# EAGLE design vt100-addon (EAGLE 6.4)
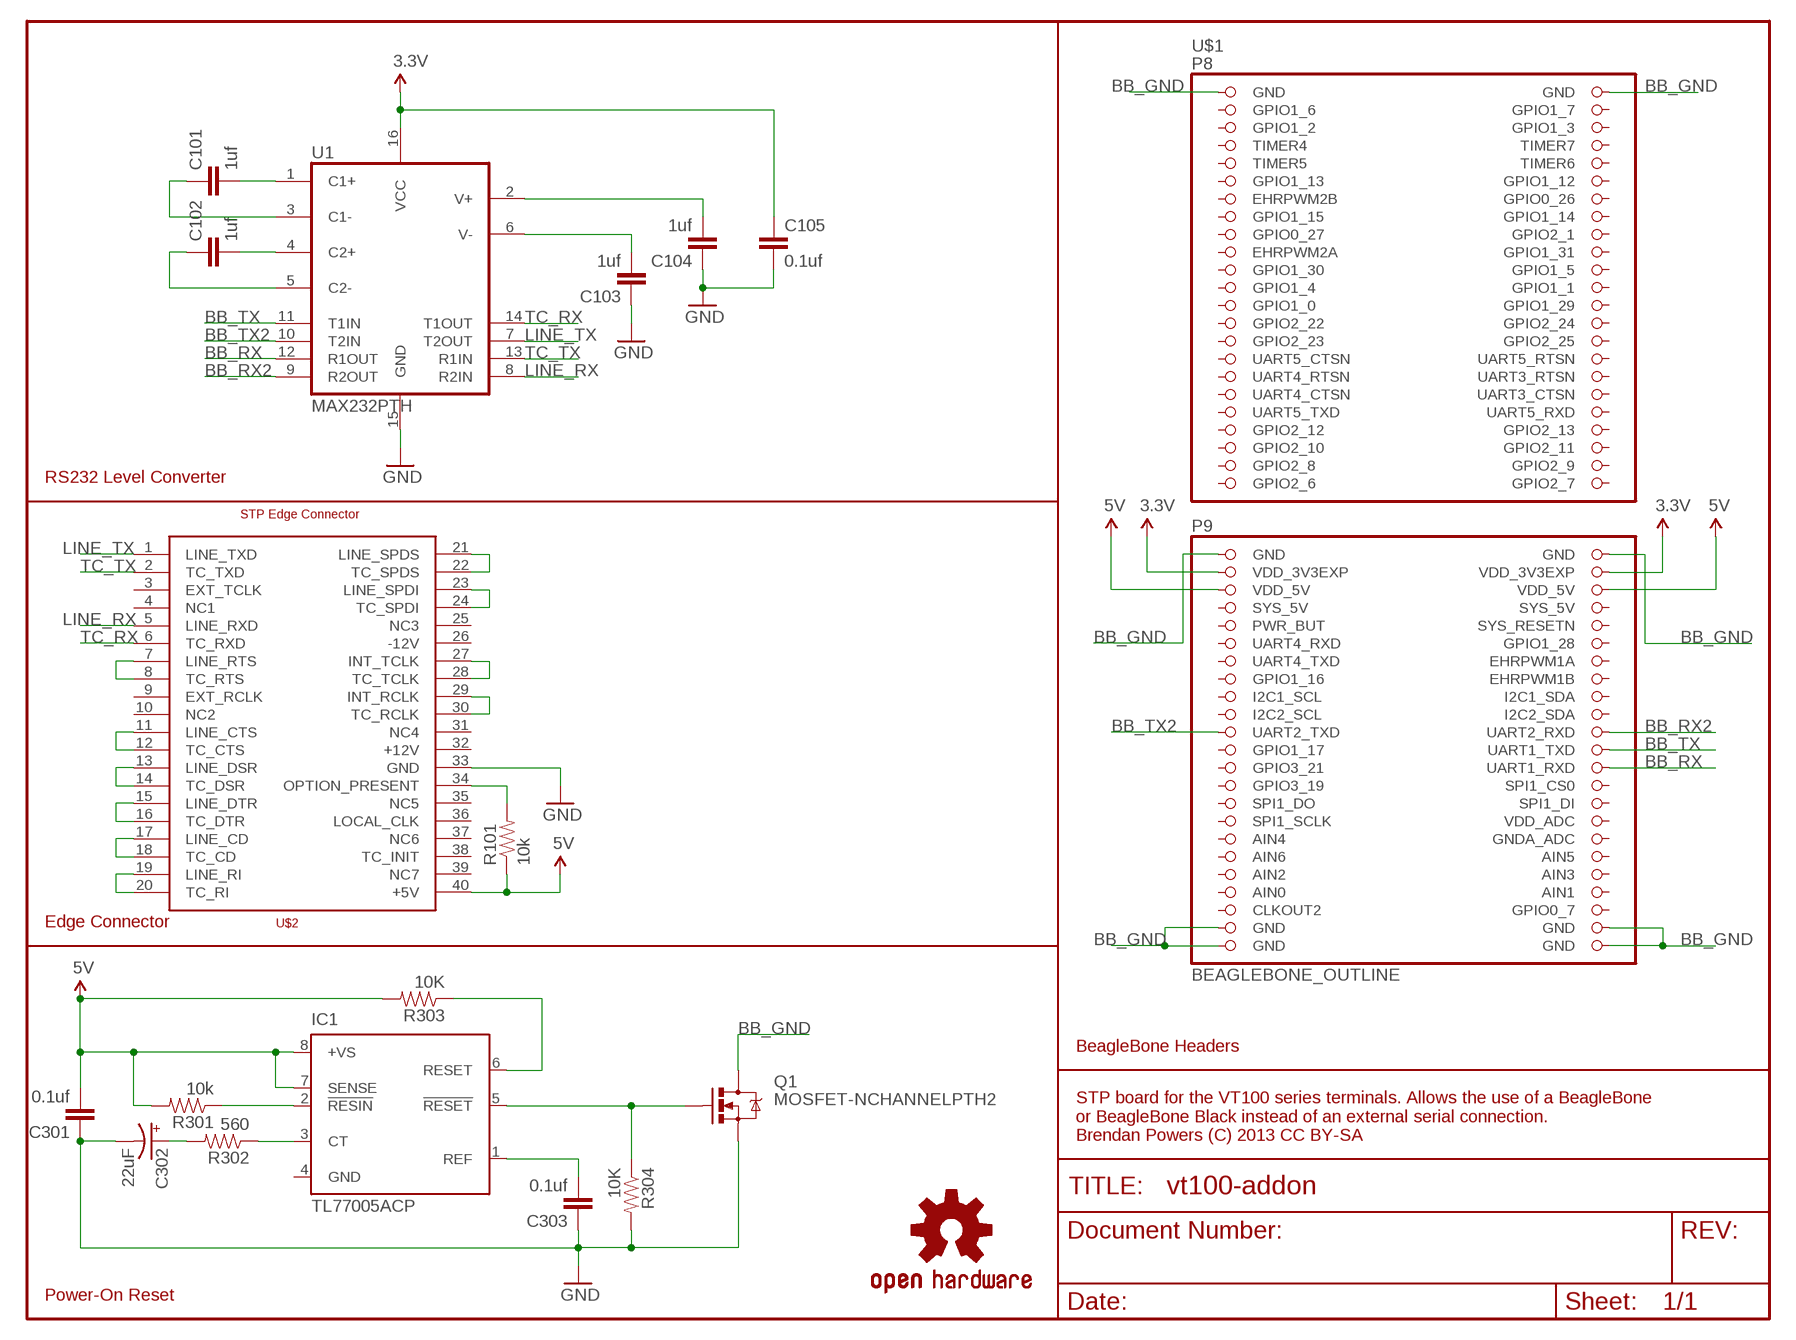
[diagram p0: schematic, sheet 1]

## Parts
C101  1uf  CAPPTH  [CAP-PTH-SMALL]
C102  1uf  CAPPTH  [CAP-PTH-SMALL]
C103  1uf  CAPPTH  [CAP-PTH-SMALL]
C104  1uf  CAPPTH  [CAP-PTH-SMALL]
C105  0.1uf  CAPPTH  [CAP-PTH-SMALL]
C301  0.1uf  CAPPTH  [CAP-PTH-SMALL]
C302  22uF  CAP_POLPTH1  [CPOL-RADIAL-100UF-25V]
C303  0.1uf  CAPPTH  [CAP-PTH-SMALL]
IC1  TL77005ACP  [DIL08]
Q1  MOSFET-NCHANNELPTH2  [TO220V]
R101  10k  RESISTORPTH-1/4W  [AXIAL-0.4]
R301  10k  RESISTORPTH-1/4W  [AXIAL-0.4]
R302  560  RESISTORPTH-1/4W  [AXIAL-0.4]
R303  10K  RESISTORPTH-1/4W  [AXIAL-0.4]
R304  10K  RESISTORPTH-1/4W  [AXIAL-0.4]
U1  MAX232PTH  [DIL16]
U$1  BEAGLEBONE_OUTLINE  [BEAGLEBONE_SHIELD]
U$2  STP_EDGE  [STP_EDGE]
U$7  OSHW-LOGOL  [OSHW-LOGO-L]

## Nets
3.3V: C105.1 U1.16(VCC) U$1.49(VDD_3V3EXP) U$1.50(VDD_3V3EXP)
5V: C301.2 IC1.7(SENSE) IC1.8(+VS) R101.P$1 R301.P$2 R303.P$2 U$1.51(VDD_5V) U$1.52(VDD_5V) U$2.40(+5V)
BB_GND: Q1.2(D) U$1.1(GND) U$1.2(GND) U$1.47(GND) U$1.48(GND) U$1.89(GND) U$1.90(GND) U$1.91(GND) U$1.92(GND)
BB_RX: U1.12(R1OUT) U$1.72(UART1_RXD)
BB_RX2: U1.9(R2OUT) U$1.68(UART2_RXD)
BB_TX: U1.11(T1IN) U$1.70(UART1_TXD)
BB_TX2: U1.10(T2IN) U$1.67(UART2_TXD)
GND: C103.1 C104.1 C105.2 C301.1 C302.2(-) C303.1 Q1.3(S) R304.P$2 U1.15(GND) U$2.33(GND)
LINE_RX: U1.8(R2IN) U$2.5(LINE_RXD)
LINE_TX: U1.7(T2OUT) U$2.1(LINE_TXD)
N$1: C101.2 U1.1(C1+)
N$2: C101.1 U1.3(C1-)
N$3: C102.2 U1.4(C2+)
N$4: C102.1 U1.5(C2-)
N$5: R101.P$2 U$2.34(OPTION_PRESENT)
N$6: C104.2 U1.2(V+)
N$7: C103.2 U1.6(V-)
N$8: U$2.7(LINE_RTS) U$2.8(TC_RTS)
N$9: U$2.11(LINE_CTS) U$2.12(TC_CTS)
N$10: U$2.13(LINE_DSR) U$2.14(TC_DSR)
N$11: U$2.15(LINE_DTR) U$2.16(TC_DTR)
N$12: U$2.17(LINE_CD) U$2.18(TC_CD)
N$13: U$2.19(LINE_RI) U$2.20(TC_RI)
N$14: U$2.21(LINE_SPDS) U$2.22(TC_SPDS)
N$15: U$2.23(LINE_SPDI) U$2.24(TC_SPDI)
N$16: U$2.27(INT_TCLK) U$2.28(TC_TCLK)
N$17: U$2.29(INT_RCLK) U$2.30(TC_RCLK)
N$18: IC1.3(CT) R302.P$1
N$19: C303.2 IC1.1(REF)
N$20: C302.1(+) R302.P$2
N$21: IC1.6(RESET) R303.P$1
N$22: IC1.5(!RESET) Q1.1(G) R304.P$1
N$24: IC1.2(!RESIN) R301.P$1
TC_RX: U1.14(T1OUT) U$2.6(TC_RXD)
TC_TX: U1.13(R1IN) U$2.2(TC_TXD)
Unconnected: U$1.3(GPIO1_6) U$1.4(GPIO1_7) U$1.5(GPIO1_2) U$1.6(GPIO1_3) U$1.7(TIMER4) U$1.8(TIMER7) U$1.9(TIMER5) U$1.10(TIMER6) U$1.11(GPIO1_13) U$1.12(GPIO1_12) U$1.13(EHRPWM2B) U$1.14(GPIO0_26) U$1.15(GPIO1_15) U$1.16(GPIO1_14) U$1.17(GPIO0_27) U$1.18(GPIO2_1) U$1.19(EHRPWM2A) U$1.20(GPIO1_31) U$1.21(GPIO1_30) U$1.22(GPIO1_5) U$1.23(GPIO1_4) U$1.24(GPIO1_1) U$1.25(GPIO1_0) U$1.26(GPIO1_29) U$1.27(GPIO2_22) U$1.28(GPIO2_24) U$1.29(GPIO2_23) U$1.30(GPIO2_25) U$1.31(UART5_CTSN) U$1.32(UART5_RTSN) U$1.33(UART4_RTSN) U$1.34(UART3_RTSN) U$1.35(UART4_CTSN) U$1.36(UART3_CTSN) U$1.37(UART5_TXD) U$1.38(UART5_RXD) U$1.39(GPIO2_12) U$1.40(GPIO2_13) U$1.41(GPIO2_10) U$1.42(GPIO2_11) U$1.43(GPIO2_8) U$1.44(GPIO2_9) U$1.45(GPIO2_6) U$1.46(GPIO2_7) U$1.54(SYS_5V) U$1.55(PWR_BUT) U$1.56(SYS_RESETN) U$1.57(UART4_RXD) U$1.58(GPIO1_28) U$1.59(UART4_TXD) U$1.60(EHRPWM1A) U$1.61(GPIO1_16) U$1.62(EHRPWM1B) U$1.63(I2C1_SCL) U$1.64(I2C1_SDA) U$1.65(I2C2_SCL) U$1.66(I2C2_SDA) U$1.69(GPIO1_17) U$1.71(GPIO3_21) U$1.73(GPIO3_19) U$1.74(SPI1_CS0) U$1.75(SPI1_DO) U$1.76(SPI1_DI) U$1.77(SPI1_SCLK) U$1.78(VDD_ADC) U$1.79(AIN4) U$1.80(GNDA_ADC) U$1.81(AIN6) U$1.82(AIN5) U$1.83(AIN2) U$1.84(AIN3) U$1.86(AIN1) U$1.87(CLKOUT2) U$1.88(GPIO0_7) U$2.3(EXT_TCLK) U$2.4(NC1) U$2.9(EXT_RCLK) U$2.10(NC2) U$2.25(NC3) U$2.26(-12V) U$2.31(NC4) U$2.32(+12V) U$2.35(NC5) U$2.36(LOCAL_CLK) U$2.37(NC6) U$2.38(TC_INIT) U$2.39(NC7)

## Notes on the sheet
- RS232 Level Converter
- Edge Connector
- BeagleBone Headers
- STP board for the VT100 series terminals. Allows the use of a BeagleBone
  or BeagleBone Black instead of an external serial connection.
  Brendan Powers (C) 2013 CC BY-SA
- Power-On Reset

## Power pins joined to a net without a drawn wire
AIN0: U$1.85(AIN0)
GND: IC1.4(GND)
SYS_5V: U$1.53(SYS_5V)

## Library data of the parts
C101-C105 C301 C303 = sparkfun:CAP: Capacitor Standard 0603 ceramic capacitor, and 0.1" leaded capacitor.
C302 = sparkfun:CAP_POL: Capacitor Polarized These are standard SMD and PTH capacitors. Normally 10uF, 47uF, and 100uF in electrolytic and tantalum varieties. Always verify the external diameter of the through hole cap, it varies with capacity, voltage, and manufacturer. The EIA devices should be standard.
IC1 = linear:TL770*: SUPPLY VOLTAGE SUPERVISORS TL7700A Series Source: http://www.st.com/stonline/products/literature/ds/1528.pdf
Q1 = sparkfun:MOSFET-NCHANNEL
R101 R301-R304 = sparkfun:RESISTOR: Resistor Basic schematic elements and footprints for 0603, 1206, and PTH resistors.
U1 = sparkfun:MAX232: RS232 Transceiver Very common IC. This is generically called 'MAX232', but works with the 3V equivalent MAX3232 generic ICs. Field tested and mother approved. Spark Fun Electronics SKU : COM-00316 (DIP) and COM-00589 (SMD)
U$1 = custom:BEAGLEBONE_OUTLINE: Should match A3 pinout - but not completely tested
U$2 = custom:STP_EDGE
U$7 = sparkfun:OSHW-LOGO: Open Source Hardware Logo This logo indicates the piece of hardware it is found on incorporates a OSHW license and/or adheres to the definition of open source hardware found here: http://freedomdefined.org/OSHW

## Board
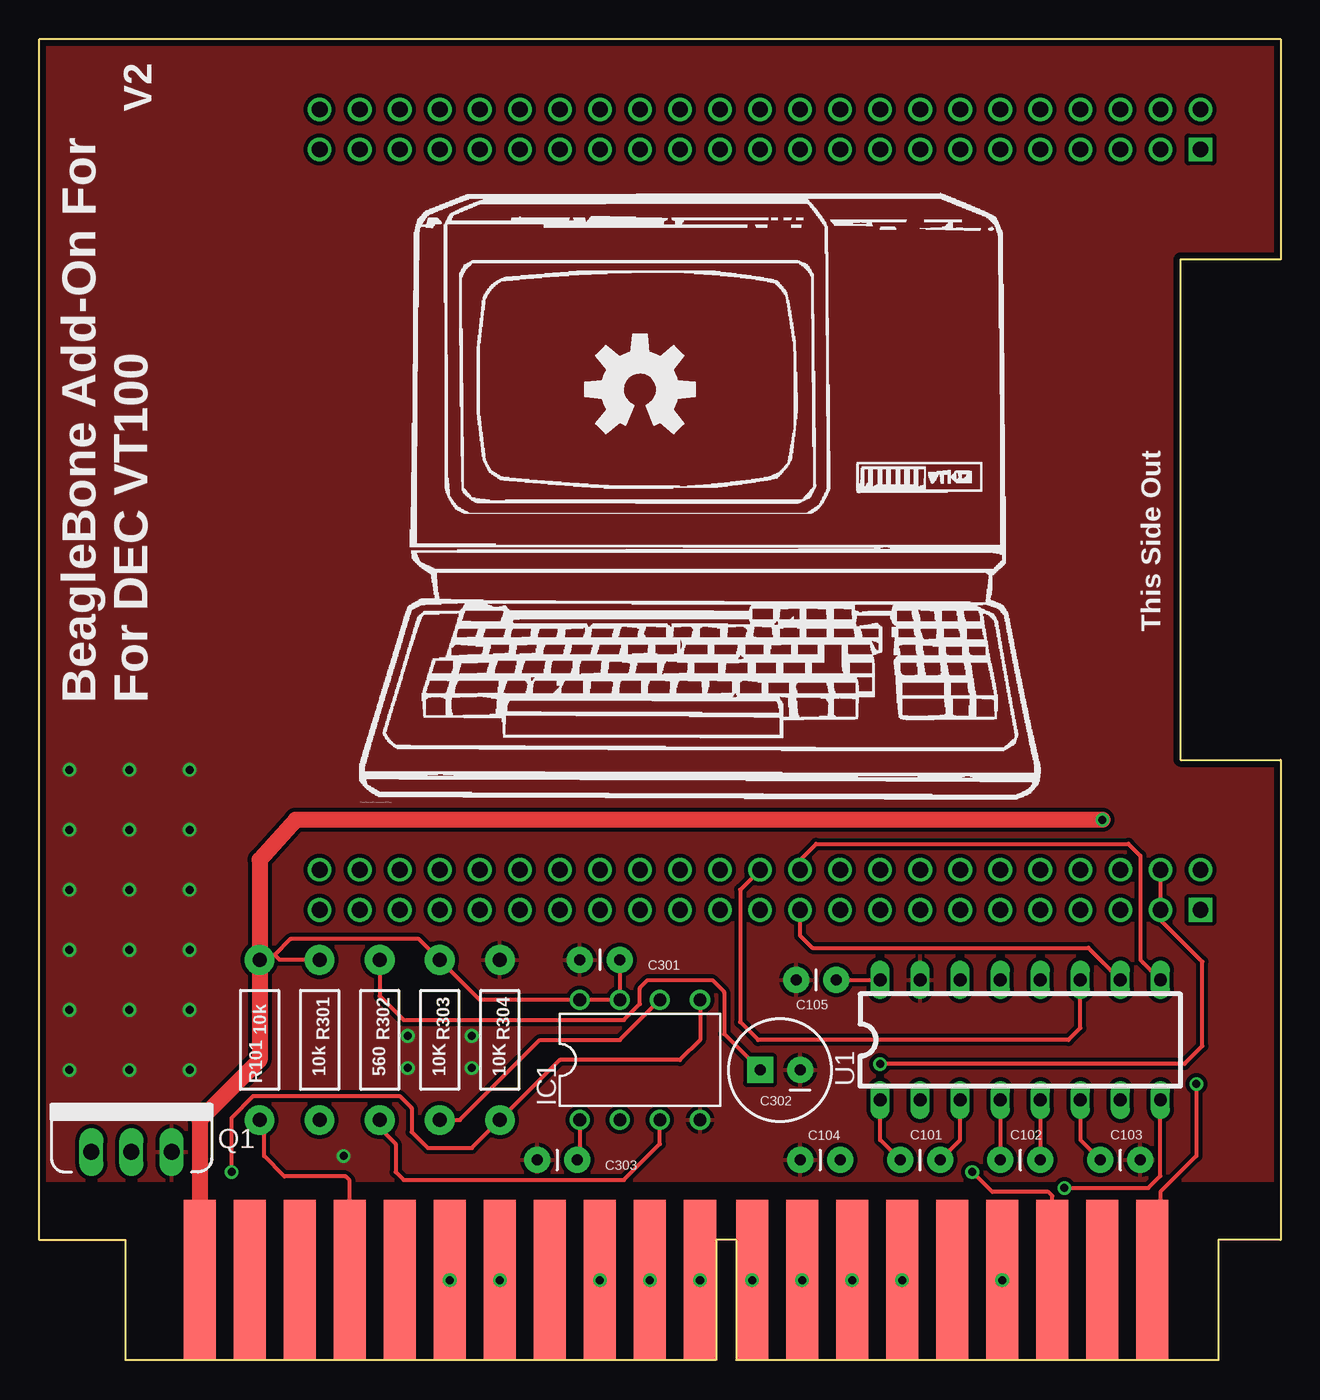
[diagram p1: board, top side]
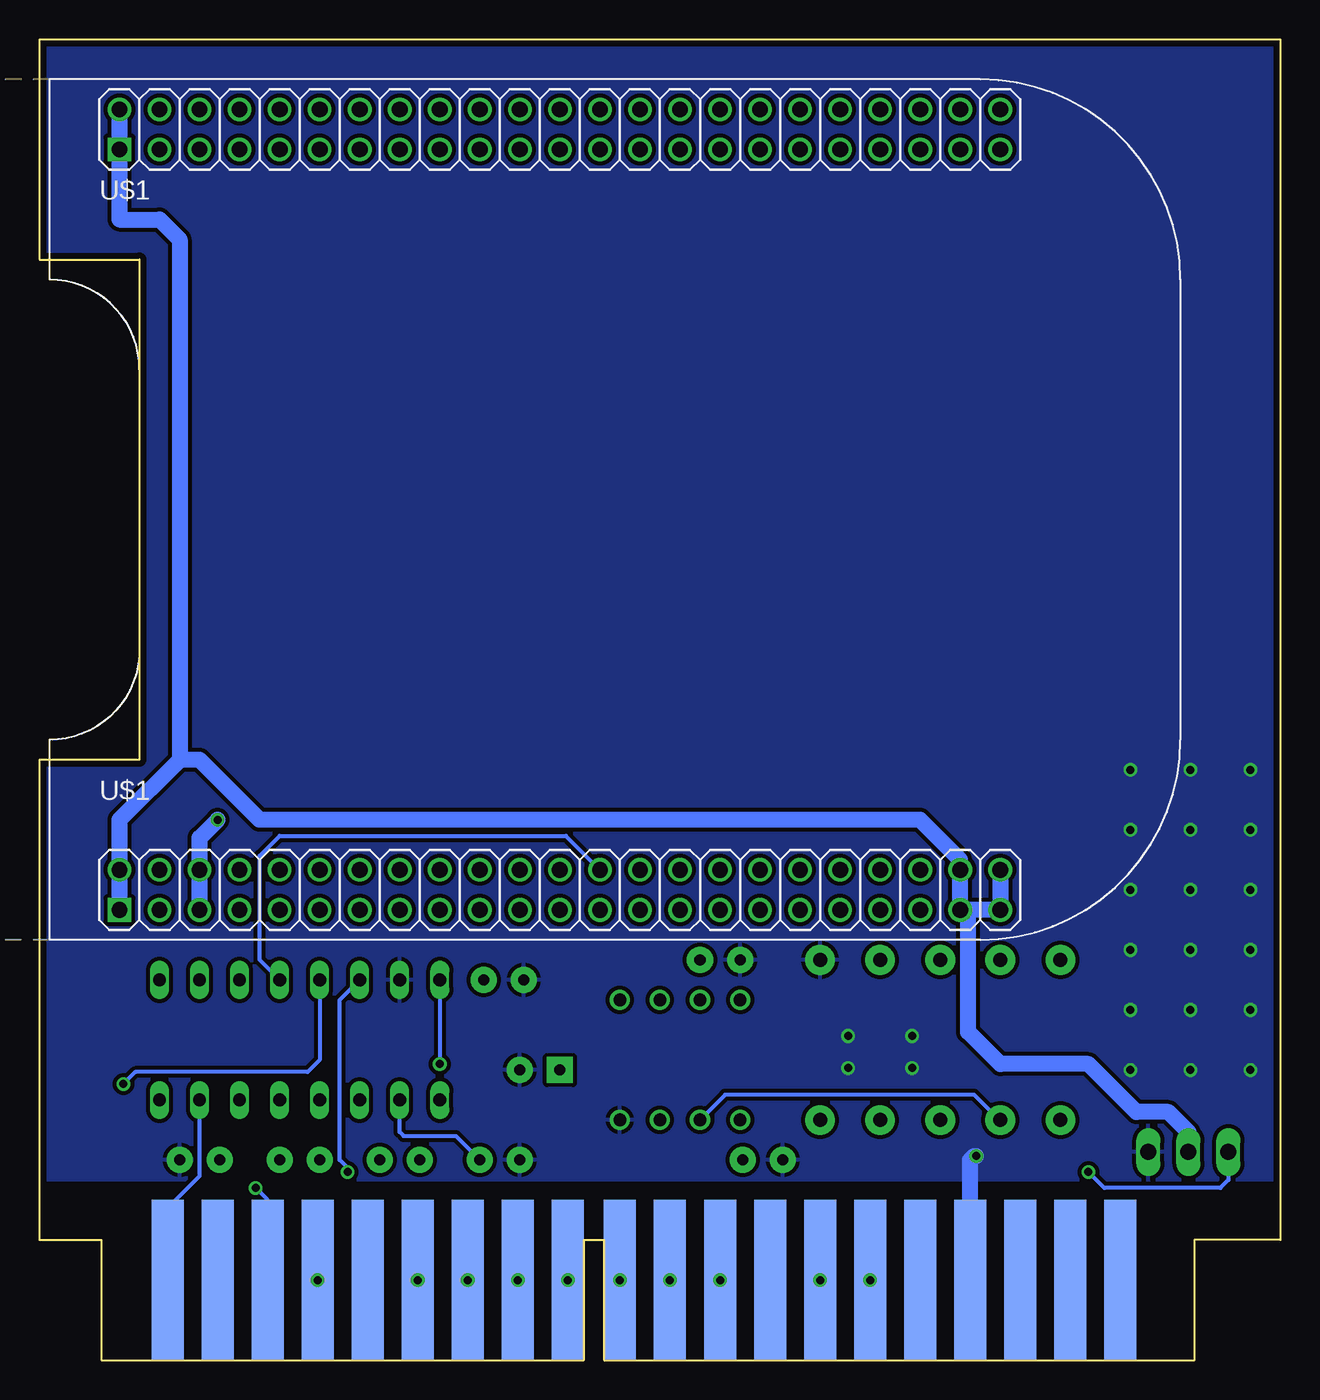
[diagram p2: board, bottom side, seen from below]

Size 78.74 x 83.82 mm. Coordinates in mm from the lower left corner, seen from the top.
Outline: 0,7.62 0,83.82 78.74,83.82 78.74,69.85 72.39,69.85 72.39,38.1 78.74,38.1 78.74,7.62 74.8,7.62 74.8,0 44.2,0 44.2,7.62 42.93,7.62 42.93,0 5.46,0 5.46,7.62 0,7.62
Copper layers (1*16): Top 0.0356mm / dielectric 1.5011mm / Bottom 0.0356mm
Design rules "LaenPCBOrder *": minimum track width 6mil, minimum drill 13mil, track to track 10mil, track to pad 10mil, pad to pad 10mil, via to via 10mil, smd to smd 10mil, copper to edge 15mil, drill to drill 6mil, minimum pad ring 7mil, minimum via ring 7mil, stop-mask expansion 4mil, vias tented up to drill 20mil, thermal gap 10mil

### Footprints (pad centres in the part's own frame; a part is rotated, then mirrored left to right if it is on the bottom)
CAP-PTH-SMALL = drill 0.7 pad 1.651: 1 0,0; 2 2.54,0
CPOL-RADIAL-100UF-25V = drill 0.7 pad 1.651 square: 1 1.27,0 | drill 0.7 pad 1.651: 2 -1.27,0
DIL08 = drill 0.813 pad 1.27: 1 -3.81,-3.81; 2 -1.27,-3.81; 3 1.27,-3.81; 4 3.81,-3.81; 5 3.81,3.81; 6 1.27,3.81; 7 -1.27,3.81; 8 -3.81,3.81
TO220V = drill 1.016 long: 1 -2.54,0; 2 0,0; 3 2.54,0
AXIAL-0.4 = drill 0.9 pad 1.88: P$1 -5.08,0; P$2 5.08,0
DIL16 = drill 0.813 long: 1 -8.89,-3.81; 2 -6.35,-3.81; 3 -3.81,-3.81; 4 -1.27,-3.81; 5 1.27,-3.81; 6 3.81,-3.81; 7 6.35,-3.81; 8 8.89,-3.81; 9 8.89,3.81; 10 6.35,3.81; 11 3.81,3.81; 12 1.27,3.81; 13 -1.27,3.81; 14 -3.81,3.81; 15 -6.35,3.81; 16 -8.89,3.81
BEAGLEBONE_SHIELD = drill 1 square: 1 4.445,19.05; 47 52.705,19.05 | drill 1: 2 1.905,19.05; 3 4.445,21.59; 4 1.905,21.59; 5 4.445,24.13; 6 1.905,24.13; 7 4.445,26.67; 8 1.905,26.67; 9 4.445,29.21; 10 1.905,29.21; 11 4.445,31.75; 12 1.905,31.75; 13 4.445,34.29; 14 1.905,34.29; 15 4.445,36.83; 16 1.905,36.83; 17 4.445,39.37; 18 1.905,39.37; 19 4.445,41.91; 20 1.905,41.91; 21 4.445,44.45; 22 1.905,44.45; 23 4.445,46.99; 24 1.905,46.99; 25 4.445,49.53; 26 1.905,49.53; 27 4.445,52.07; 28 1.905,52.07; 29 4.445,54.61; 30 1.905,54.61; 31 4.445,57.15; 32 1.905,57.15; 33 4.445,59.69; 34 1.905,59.69; 35 4.445,62.23; 36 1.905,62.23; 37 4.445,64.77; 38 1.905,64.77; 39 4.445,67.31; 40 1.905,67.31; 41 4.445,69.85; 42 1.905,69.85; 43 4.445,72.39; 44 1.905,72.39; 45 4.445,74.93; 46 1.905,74.93; 48 50.165,19.05; 49 52.705,21.59; 50 50.165,21.59; 51 52.705,24.13; 52 50.165,24.13; 53 52.705,26.67; 54 50.165,26.67; 55 52.705,29.21; 56 50.165,29.21; 57 52.705,31.75; 58 50.165,31.75; 59 52.705,34.29; 60 50.165,34.29; 61 52.705,36.83; 62 50.165,36.83; 63 52.705,39.37; 64 50.165,39.37; 65 52.705,41.91; 66 50.165,41.91; 67 52.705,44.45; 68 50.165,44.45; 69 52.705,46.99; 70 50.165,46.99; 71 52.705,49.53; 72 50.165,49.53; 73 52.705,52.07; 74 50.165,52.07; 75 52.705,54.61; 76 50.165,54.61; 77 52.705,57.15; 78 50.165,57.15; 79 52.705,59.69; 80 50.165,59.69; 81 52.705,62.23; 82 50.165,62.23; 83 52.705,64.77; 84 50.165,64.77; 85 52.705,67.31; 86 50.165,67.31; 87 52.705,69.85; 88 50.165,69.85; 89 52.705,72.39; 90 50.165,72.39; 91 52.705,74.93; 92 50.165,74.93
STP_EDGE = smd 2.032 x 10.16 bottom: 1 70.612,5.08; 3 67.437,5.08; 5 64.262,5.08; 7 61.087,5.08; 9 57.912,5.08; 11 54.737,5.08; 13 51.562,5.08; 15 48.387,5.08; 17 45.212,5.08; 19 41.91,5.08; 21 38.735,5.08; 23 35.56,5.08; 25 32.385,5.08; 27 29.21,5.08; 29 26.035,5.08; 31 22.86,5.08; 33 19.685,5.08; 35 16.51,5.08; 37 13.335,5.08; 39 10.16,5.08 | smd 2.032 x 10.16: 2 70.612,5.08; 4 67.437,5.08; 6 64.262,5.08; 8 61.087,5.08; 10 57.912,5.08; 12 54.737,5.08; 14 51.562,5.08; 16 48.387,5.08; 18 45.212,5.08; 20 41.91,5.08; 22 38.735,5.08; 24 35.56,5.08; 26 32.385,5.08; 28 29.21,5.08; 30 26.035,5.08; 32 22.86,5.08; 34 19.685,5.08; 36 16.51,5.08; 38 13.335,5.08; 40 10.16,5.08

### Placement (x,y rotation side)
C101  57.15,12.7 180 top
C102  63.5,12.7 180 top
C103  69.85,12.7 180 top
C104  48.26,12.7 0 top
C105  50.55,24.13 180 top
C301  34.29,25.4 0 top
C302  46.99,18.41 180 top
C303  31.57,12.7 0 top
IC1  38.1,19.05 0 top
Q1  5.84,13.21 0 top
R101  13.97,20.32 270 top
R301  17.78,20.32 90 top
R302  21.59,20.32 90 top
R303  25.4,20.32 90 top
R304  29.21,20.32 90 top
U1  62.23,20.32 0 top
U$1  92.71,81.28 270 bottom
U$2  0,0 0 top
U$7  38.1,61.59 0 top

### Tracks (layer width: path | path; a pad name or v marks a point on that pad's centre or on a via)
3.3V  (via drill 0.51)
  Top 0.254: U$1.50 U$1.49 71.12,27.94 73.79,25.27 73.79,19.94 72.64,18.8 v53.34,18.8 | C105.1 U1.16
  Bottom 0.254: U1.16 v53.34,18.8
5V  (via drill 0.51)
  Top 0.254: C301.2 IC1.7 IC1.8 27.94,22.86 R303.P$2 24.08,26.72 15.93,26.72 14.92,25.72 | 14.92,25.72 R101.P$1 | R301.P$2 15.24,25.4 14.92,25.72
  Top 1.016: v67.44,34.29 16.26,34.29 13.97,31.75 R101.P$1 13.97,19.05 10.16,15.24 U$2.40
  Bottom 1.016: U$1.52 U$1.51 68.58,33.15 v67.44,34.29 | 14.35,25.4 R101.P$1
BB_GND
  Bottom 1.016: U$1.2 U$1.1 73.66,72.39 71.12,72.39 69.85,71.12 69.85,38.1 | 69.85,38.1 73.66,34.29 U$1.48 U$1.47 | U$1.92 U$1.91 | U$1.91 U$1.89 | U$1.89 U$1.90 20.32,31.75 22.86,34.29 64.77,34.29 68.58,38.1 69.85,38.1 | 17.7,28.5 U$1.91 | Q1.2 5.84,14.48 7.11,15.75 9.14,15.75 12.19,18.8 17.78,18.8 19.81,20.83 19.81,28.07 U$1.89
BB_RX
  Bottom 0.254: U1.12 64.77,25.4 64.77,32 63.5,33.27 45.34,33.27 U$1.72
BB_RX2
  Top 0.254: U$1.68 48.26,31.75 49.28,32.77 69.09,32.77 69.85,32 69.85,25.4 U1.9
BB_TX
  Top 0.254: U$1.70 44.45,29.84 44.45,21.46 45.59,20.32 65.28,20.32 66.04,21.08 U1.11
BB_TX2
  Top 0.254: U$1.67 48.26,26.92 49.02,26.16 66.55,26.16 U1.10
GND  (via drill 0.51)
  Bottom 1.016: U$2.33 19.68,12.7 19.43,12.95 v19.3,12.95
  other vias: 1.91,37.47 1.91,33.66 1.91,29.84 1.91,26.04 1.91,22.23 5.71,37.47 5.71,33.66 5.71,29.84 5.71,26.04 9.53,37.47 9.53,33.66 9.53,29.84 27.43,20.57 27.43,18.54 23.37,18.54 23.37,20.57 9.53,26.04 5.71,22.23 9.53,22.23 9.53,18.41 5.71,18.41 1.91,18.41
  pour Bottom (isolate 0.025): 0,111.76 0,11.43 95.25,11.43 95.25,111.76
  pour Top (isolate 0.025): 0,111.76 0,11.43 95.25,11.43 95.25,111.76
LINE_RX  (via drill 0.51)
  Top 0.254: v65.02,10.92 70.36,10.92 71.12,11.68 U1.8
  Bottom 0.254: U$2.5 64.26,10.16 v65.02,10.92
LINE_TX
  Bottom 0.254: U$2.1 70.61,9.65 68.58,11.68 U1.7
N$1
  Top 0.254: C101.2 53.34,13.97 U1.1
N$2
  Top 0.254: C101.1 58.42,13.97 U1.3
N$3
  Top 0.254: U1.4 C102.2
N$4
  Top 0.254: U1.5 C102.1
N$5
  Top 0.254: U$2.34 19.68,11.4 19.43,11.66 15.54,11.66 14.25,12.95 14.25,14.88 R101.P$2
N$6
  Bottom 0.254: C104.2 52.32,14.22 55.63,14.22 55.88,14.48 U1.2
N$7
  Top 0.254: C103.2 66.04,13.97 U1.6
N$8  (via drill 0.51)
  other vias: 61.09,5.08
N$9  (via drill 0.51)
  other vias: 54.74,5.08
N$10  (via drill 0.51)
  other vias: 51.56,5.08
N$11  (via drill 0.51)
  other vias: 48.39,5.08
N$12  (via drill 0.51)
  other vias: 45.21,5.08
N$13  (via drill 0.51)
  other vias: 41.91,5.08
N$14  (via drill 0.51)
  other vias: 38.73,5.08
N$15  (via drill 0.51)
  other vias: 35.56,5.08
N$16  (via drill 0.51)
  other vias: 29.21,5.08
N$17  (via drill 0.51)
  other vias: 26.04,5.08
N$18
  Top 0.254: R302.P$1 21.59,14.73 22.61,13.72 22.61,11.94 23.11,11.43 37.08,11.43 39.37,13.72 IC1.3
N$19
  Top 0.254: IC1.1 34.29,12.88 C303.2
N$20
  Top 0.254: R302.P$2 21.59,23.11 23.11,21.59 37.08,21.59 38.1,22.61 38.1,23.62 38.61,24.13 42.67,24.13 43.43,23.37 43.43,20.7 C302.1
N$21
  Top 0.254: R303.P$1 26.67,15.24 31.75,20.32 36.83,20.32 IC1.6
N$22  (via drill 0.51)
  Top 0.254: IC1.5 41.91,20.32 40.64,19.05 33.02,19.05 R304.P$1 27.43,13.46 24.64,13.46 23.62,14.48 23.62,16 22.86,16.76 13.56,16.76 12.19,15.37 v12.19,11.94
  Bottom 0.254: Q1.1 3.3,11.43 3.81,10.92 11.18,10.92 v12.19,11.94
N$24
  Bottom 0.254: R301.P$1 17.83,15.24 19.43,16.84 35.23,16.84 IC1.2
TC_RX  (via drill 0.51)
  Top 0.254: U$2.6 64.26,10.41 64.01,10.67 60.45,10.67 v59.18,11.94
  Bottom 0.254: v59.18,11.94 59.18,12.19 59.69,12.7 59.69,22.86 U1.14
TC_TX  (via drill 0.51)
  Top 0.254: v73.41,17.53 73.41,12.95 71.12,10.67 71.12,5.59 U$2.2
  Bottom 0.254: U1.13 60.96,19.05 61.72,18.29 72.64,18.29 v73.41,17.53

### Text on the board
tPlace: V2 | This Side Out | BeagleBone Add-On For / For DEC VT100 | /Users/brendan/Documents/vt100.bmp